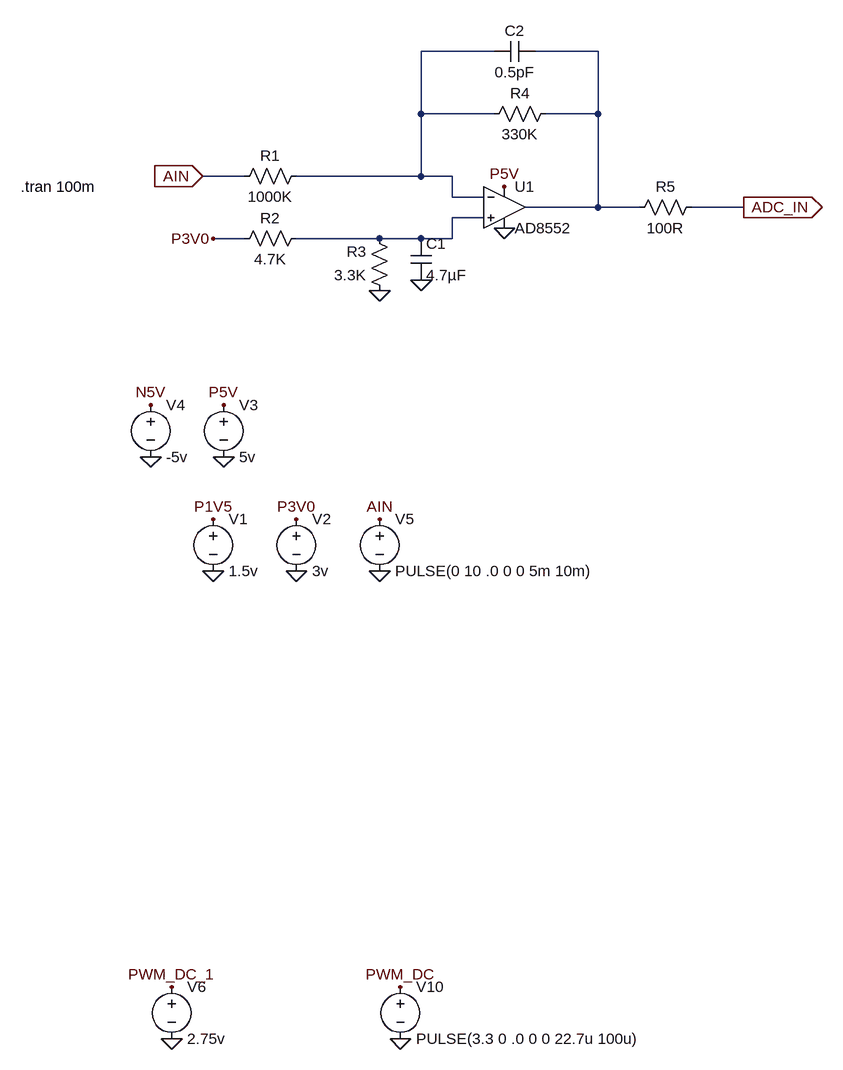
[diagram p0: schematic AD8551_原版电路.asc]
AD8551_原版电路.asc, the LTspice schematic file:
Version 4
SHEET 1 1680 1284
WIRE -608 -256 -720 -256
WIRE -448 -256 -544 -256
WIRE -720 -160 -720 -256
WIRE -608 -160 -720 -160
WIRE -448 -160 -448 -256
WIRE -448 -160 -528 -160
WIRE -992 -64 -1056 -64
WIRE -720 -64 -720 -160
WIRE -720 -64 -912 -64
WIRE -672 -64 -720 -64
WIRE -672 -32 -672 -64
WIRE -624 -32 -672 -32
WIRE -448 -16 -448 -160
WIRE -448 -16 -560 -16
WIRE -384 -16 -448 -16
WIRE -224 -16 -304 -16
WIRE -624 0 -672 0
WIRE -992 32 -1040 32
WIRE -784 32 -912 32
WIRE -720 32 -784 32
WIRE -672 32 -672 0
WIRE -672 32 -720 32
FLAG -1040 544 0
FLAG -912 544 0
FLAG -1024 368 0
FLAG -1136 368 0
FLAG -784 544 0
FLAG -1136 288 N5V
FLAG -1024 288 P5V
FLAG -752 1264 0
FLAG -752 1184 PWM_DC
FLAG -1040 464 P1V5
FLAG -912 464 P3V0
FLAG -1104 1264 0
FLAG -1104 1184 PWM_DC_1
FLAG -224 -16 ADC_IN
IOPIN -224 -16 Out
FLAG -1056 -64 AIN
IOPIN -1056 -64 In
FLAG -1040 32 P3V0
FLAG -592 -48 P5V
FLAG -592 16 0
FLAG -784 112 0
FLAG -720 96 0
FLAG -784 464 AIN
SYMBOL voltage -1040 448 R0
WINDOW 123 0 0 Left 0
WINDOW 39 0 0 Left 0
SYMATTR InstName V1
SYMATTR Value 1.5v
SYMBOL voltage -912 448 R0
WINDOW 123 0 0 Left 0
WINDOW 39 0 0 Left 0
SYMATTR InstName V2
SYMATTR Value 3v
SYMBOL voltage -1024 272 R0
WINDOW 123 0 0 Left 0
WINDOW 39 0 0 Left 0
SYMATTR InstName V3
SYMATTR Value 5v
SYMBOL voltage -1136 272 R0
WINDOW 123 0 0 Left 0
WINDOW 39 0 0 Left 0
SYMATTR InstName V4
SYMATTR Value -5v
SYMBOL voltage -784 448 R0
WINDOW 123 0 0 Left 0
WINDOW 39 0 0 Left 0
SYMATTR InstName V5
SYMATTR Value PULSE(0 10 .0 0 0 5m 10m)
SYMBOL voltage -752 1168 R0
WINDOW 123 0 0 Left 0
WINDOW 39 0 0 Left 0
SYMATTR InstName V10
SYMATTR Value PULSE(3.3 0 .0 0 0 22.7u 100u)
SYMBOL voltage -1104 1168 R0
WINDOW 123 0 0 Left 0
WINDOW 39 0 0 Left 0
SYMATTR InstName V6
SYMATTR Value 2.75v
SYMBOL res -896 -80 R90
WINDOW 0 0 56 VBottom 2
WINDOW 3 32 56 VTop 2
SYMATTR InstName R1
SYMATTR Value 1000K
SYMBOL res -896 16 R90
WINDOW 0 0 56 VBottom 2
WINDOW 3 32 56 VTop 2
SYMATTR InstName R2
SYMATTR Value 4.7K
SYMBOL res -768 128 R180
WINDOW 0 36 76 Left 2
WINDOW 3 36 40 Left 2
SYMATTR InstName R3
SYMATTR Value 3.3K
SYMBOL res -624 -144 R270
WINDOW 0 32 56 VTop 2
WINDOW 3 0 56 VBottom 2
SYMATTR InstName R4
SYMATTR Value 330K
SYMBOL res -400 0 R270
WINDOW 0 32 56 VTop 2
WINDOW 3 0 56 VBottom 2
SYMATTR InstName R5
SYMATTR Value 100R
SYMBOL cap -736 32 R0
SYMATTR InstName C1
SYMATTR Value 4.7µF
SYMBOL cap -544 -272 R90
WINDOW 0 0 32 VBottom 2
WINDOW 3 32 32 VTop 2
SYMATTR InstName C2
SYMATTR Value 0.5pF
SYMBOL OpAmps\\AD8552 -592 -80 R0
SYMATTR InstName U1
TEXT -1336 -48 Left 2 !.tran 100m

The netlist it stands for:
* AD8551_原版电路.asc
V1 P1V5 0 1.5v
V2 P3V0 0 3v
V3 P5V 0 5v
V4 N5V 0 -5v
V5 AIN 0 PULSE(0 10 .0 0 0 5m 10m)
V10 PWM_DC 0 PULSE(3.3 0 .0 0 0 22.7u 100u)
V6 PWM_DC_1 0 2.75v
R1 N001 AIN 1000K
R2 N003 P3V0 4.7K
R3 0 N003 3.3K
R4 N001 N002 330K
R5 N002 ADC_IN 100R
C1 N003 0 4.7µF
C2 N002 N001 0.5pF
XU1 N003 N001 P5V 0 N002 AD8552  ; pins In+ In- V+ V- OUT
.tran 100m
.backanno
.end